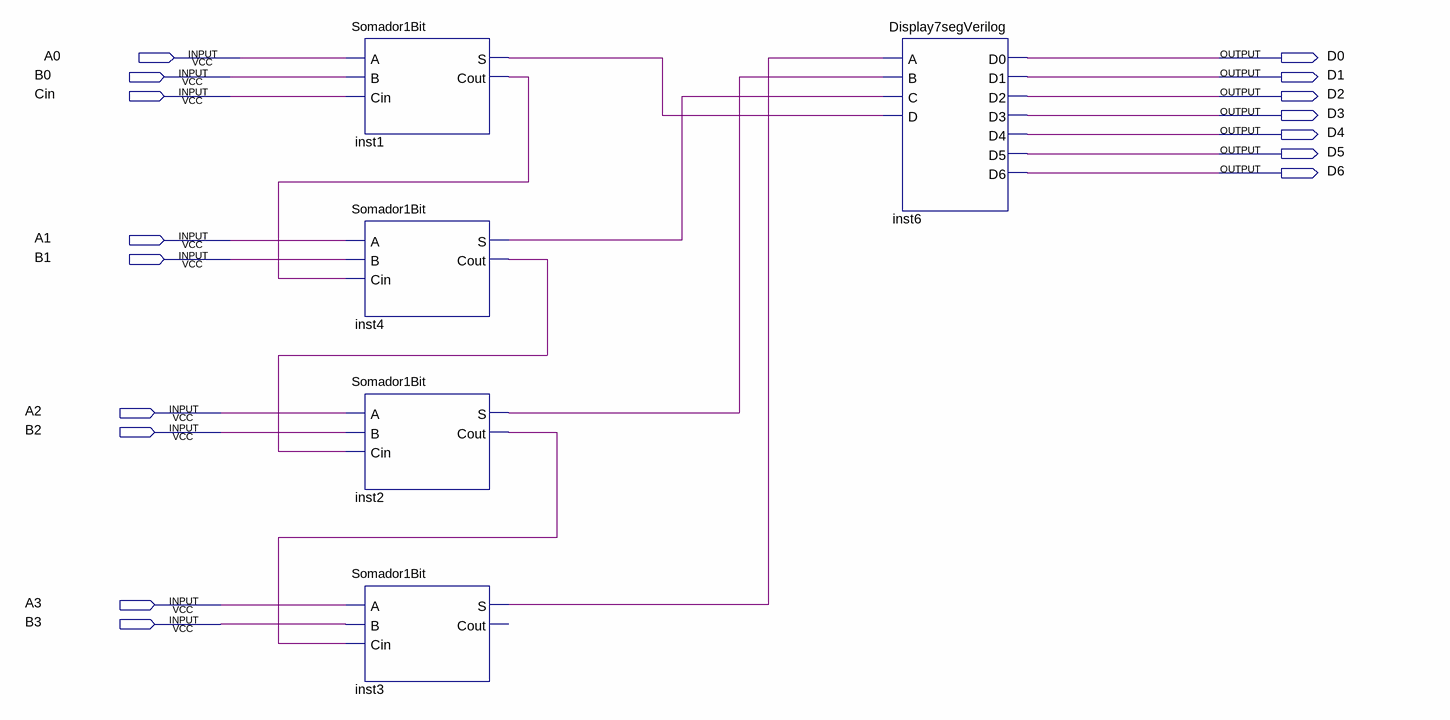
[diagram p0: schematic sheet]
// Quartus schematic Box.bdf as structural Verilog: 5 symbols, 16 pins
module Box (
  input  A0,
  input  B0,
  input  Cin,
  input  A1,
  input  B1,
  input  A2,
  input  B2,
  input  A3,
  input  B3,
  output D0,
  output D1,
  output D2,
  output D3,
  output D4,
  output D5,
  output D6
);

  wire inst1_cout, inst1_s, inst2_cout, inst2_s, inst3_s, inst4_cout, inst4_s;

  Somador1Bit inst1 (.A(A0), .B(B0), .Cin(Cin), .S(inst1_s), .Cout(inst1_cout));
  Somador1Bit inst4 (.A(A1), .B(B1), .Cin(inst1_cout), .S(inst4_s), .Cout(inst4_cout));
  Somador1Bit inst2 (.A(A2), .B(B2), .Cin(inst4_cout), .S(inst2_s), .Cout(inst2_cout));
  Somador1Bit inst3 (.A(A3), .B(B3), .Cin(inst2_cout), .S(inst3_s));  // open: Cout
  Display7segVerilog inst6 (
    .A(inst3_s), .B(inst2_s), .C(inst4_s), .D(inst1_s), .D0(D0), .D1(D1), .D2(D2), .D3(D3), .D4(D4), .D5(D5),
    .D6(D6));
endmodule
